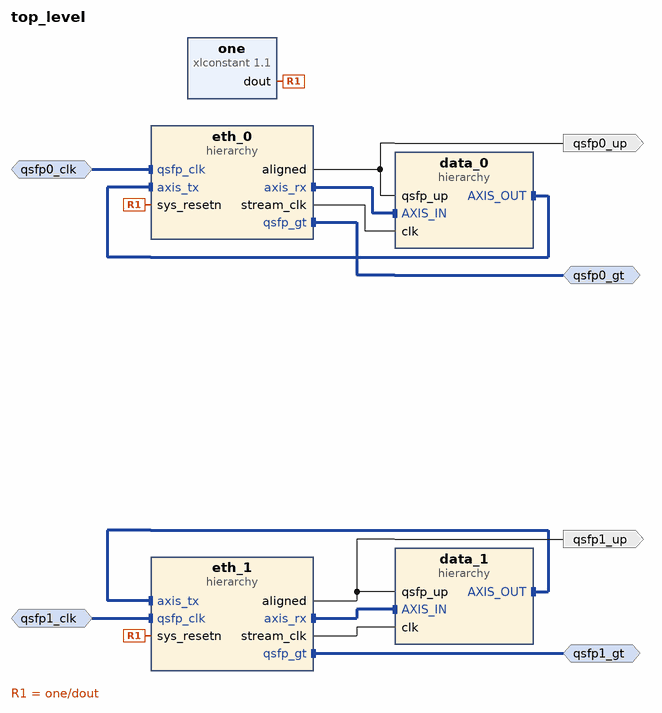
[diagram p0: block diagram of the top level]
# Vivado block design top_level, xcku15p-ffve1517-3-e, Vivado 2021.1
create_bd_design top_level

create_bd_intf_port -mode Slave -vlnv xilinx.com:interface:diff_clock_rtl:1.0 qsfp0_clk
set_property -dict {CONFIG.FREQ_HZ 156250000} [get_bd_intf_ports qsfp0_clk]
create_bd_intf_port -mode Master -vlnv xilinx.com:interface:gt_rtl:1.0 qsfp0_gt
create_bd_intf_port -mode Master -vlnv xilinx.com:interface:gt_rtl:1.0 qsfp1_gt
create_bd_intf_port -mode Slave -vlnv xilinx.com:interface:diff_clock_rtl:1.0 qsfp1_clk
set_property -dict {CONFIG.FREQ_HZ 156250000} [get_bd_intf_ports qsfp1_clk]
create_bd_port -dir O qsfp0_up
create_bd_port -dir O qsfp1_up

create_bd_cell -type hier eth_0
create_bd_cell -type hier eth_1
create_bd_cell -type ip -vlnv xilinx.com:ip:xlconstant:1.1 one
create_bd_cell -type hier data_1
create_bd_cell -type hier data_0

# ---- hierarchy /eth_0 ----
current_bd_instance /eth_0
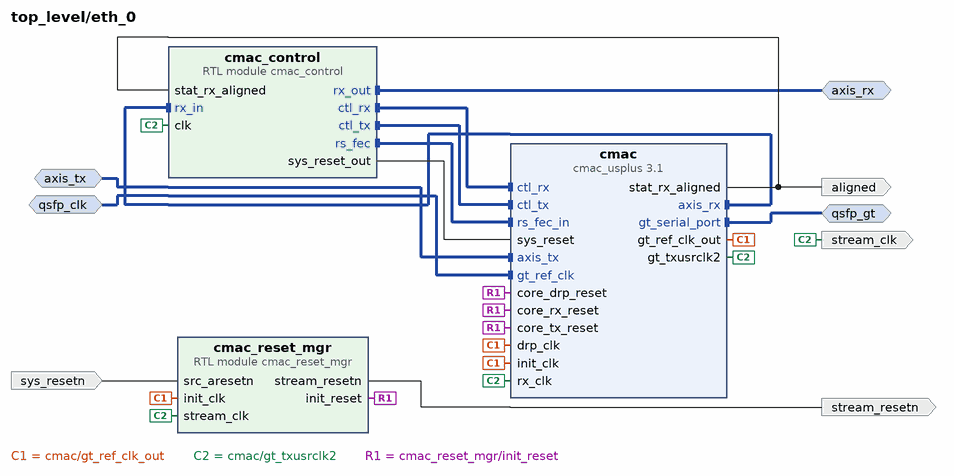
[diagram p1: block diagram inside /eth_0]
create_bd_intf_pin -mode Master -vlnv xilinx.com:interface:gt_rtl:1.0 qsfp_gt
create_bd_intf_pin -mode Slave -vlnv xilinx.com:interface:diff_clock_rtl:1.0 qsfp_clk
create_bd_intf_pin -mode Slave -vlnv xilinx.com:interface:axis_rtl:1.0 axis_tx
create_bd_intf_pin -mode Master -vlnv xilinx.com:interface:axis_rtl:1.0 axis_rx
create_bd_pin -dir I -type rst sys_resetn
create_bd_pin -dir O -type clk stream_clk
create_bd_pin -dir O -type rst stream_resetn
create_bd_pin -dir O aligned

create_bd_cell -type ip -vlnv xilinx.com:ip:cmac_usplus:3.1 cmac
set_property -dict [list \
  CONFIG.CMAC_CAUI4_MODE 1 \
  CONFIG.CMAC_CORE_SELECT CMACE4_X0Y0 \
  CONFIG.GT_DRP_CLK 156.25 \
  CONFIG.GT_GROUP_SELECT {X0Y0~X0Y3} \
  CONFIG.GT_REF_CLK_FREQ 156.25 \
  CONFIG.INCLUDE_RS_FEC 1 \
  CONFIG.NUM_LANES 4x25 \
  CONFIG.RX_FLOW_CONTROL 0 \
  CONFIG.TX_FLOW_CONTROL 0 \
  CONFIG.USER_INTERFACE AXIS \
] [get_bd_cells cmac]
create_bd_cell -type module -reference cmac_reset_mgr cmac_reset_mgr
create_bd_cell -type module -reference cmac_control cmac_control

# ---- hierarchy /eth_1 ----
current_bd_instance /eth_1
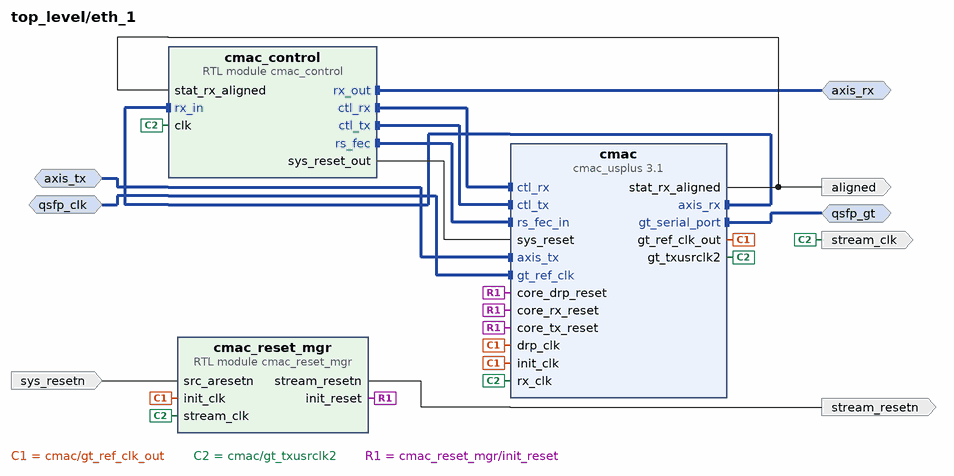
[diagram p2: block diagram inside /eth_1]
create_bd_intf_pin -mode Master -vlnv xilinx.com:interface:gt_rtl:1.0 qsfp_gt
create_bd_intf_pin -mode Slave -vlnv xilinx.com:interface:diff_clock_rtl:1.0 qsfp_clk
create_bd_intf_pin -mode Slave -vlnv xilinx.com:interface:axis_rtl:1.0 axis_tx
create_bd_intf_pin -mode Master -vlnv xilinx.com:interface:axis_rtl:1.0 axis_rx
create_bd_pin -dir I -type rst sys_resetn
create_bd_pin -dir O -type clk stream_clk
create_bd_pin -dir O -type rst stream_resetn
create_bd_pin -dir O aligned

create_bd_cell -type ip -vlnv xilinx.com:ip:cmac_usplus:3.1 cmac
set_property -dict [list \
  CONFIG.CMAC_CAUI4_MODE 1 \
  CONFIG.CMAC_CORE_SELECT CMACE4_X0Y1 \
  CONFIG.GT_DRP_CLK 156.25 \
  CONFIG.GT_GROUP_SELECT {X0Y4~X0Y7} \
  CONFIG.GT_REF_CLK_FREQ 156.25 \
  CONFIG.INCLUDE_RS_FEC 1 \
  CONFIG.NUM_LANES 4x25 \
  CONFIG.RX_FLOW_CONTROL 0 \
  CONFIG.TX_FLOW_CONTROL 0 \
  CONFIG.USER_INTERFACE AXIS \
] [get_bd_cells cmac]
create_bd_cell -type module -reference cmac_reset_mgr cmac_reset_mgr
create_bd_cell -type module -reference cmac_control cmac_control

# ---- hierarchy /data_1 ----
current_bd_instance /data_1
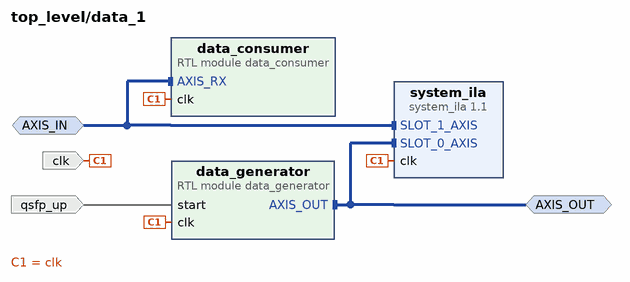
[diagram p3: block diagram inside /data_1]
create_bd_intf_pin -mode Master -vlnv xilinx.com:interface:axis_rtl:1.0 AXIS_OUT
create_bd_intf_pin -mode Slave -vlnv xilinx.com:interface:axis_rtl:1.0 AXIS_IN
create_bd_pin -dir I -type clk clk
create_bd_pin -dir I qsfp_up

create_bd_cell -type ip -vlnv xilinx.com:ip:system_ila:1.1 system_ila
set_property -dict [list \
  CONFIG.C_NUM_MONITOR_SLOTS 2 \
  CONFIG.C_SLOT 1 \
  CONFIG.C_SLOT_0_INTF_TYPE xilinx.com:interface:axis_rtl:1.0 \
  CONFIG.C_SLOT_1_INTF_TYPE xilinx.com:interface:axis_rtl:1.0 \
] [get_bd_cells system_ila]
create_bd_cell -type module -reference data_consumer data_consumer
create_bd_cell -type module -reference data_generator data_generator

# ---- hierarchy /data_0 ----
current_bd_instance /data_0
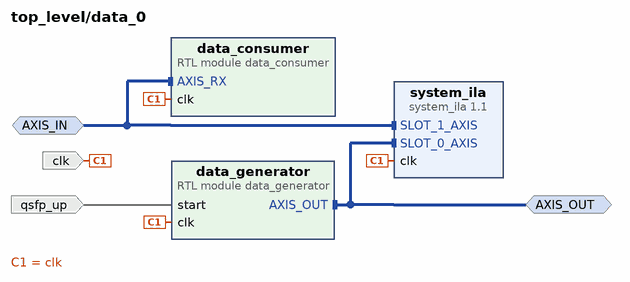
[diagram p4: block diagram inside /data_0]
create_bd_intf_pin -mode Master -vlnv xilinx.com:interface:axis_rtl:1.0 AXIS_OUT
create_bd_intf_pin -mode Slave -vlnv xilinx.com:interface:axis_rtl:1.0 AXIS_IN
create_bd_pin -dir I -type clk clk
create_bd_pin -dir I qsfp_up

create_bd_cell -type ip -vlnv xilinx.com:ip:system_ila:1.1 system_ila
set_property -dict [list \
  CONFIG.C_NUM_MONITOR_SLOTS 2 \
  CONFIG.C_SLOT 1 \
  CONFIG.C_SLOT_0_INTF_TYPE xilinx.com:interface:axis_rtl:1.0 \
  CONFIG.C_SLOT_1_INTF_TYPE xilinx.com:interface:axis_rtl:1.0 \
] [get_bd_cells system_ila]
create_bd_cell -type module -reference data_consumer data_consumer
create_bd_cell -type module -reference data_generator data_generator

# ---- connections ----

current_bd_instance /eth_0
connect_bd_intf_net [get_bd_intf_pins axis_tx] [get_bd_intf_pins cmac/axis_tx]
connect_bd_intf_net [get_bd_intf_pins cmac_control/rx_in] [get_bd_intf_pins cmac/axis_rx]
connect_bd_intf_net [get_bd_intf_pins cmac_control/ctl_rx] [get_bd_intf_pins cmac/ctl_rx]
connect_bd_intf_net [get_bd_intf_pins cmac_control/ctl_tx] [get_bd_intf_pins cmac/ctl_tx]
connect_bd_intf_net [get_bd_intf_pins cmac_control/rs_fec] [get_bd_intf_pins cmac/rs_fec_in]
connect_bd_intf_net [get_bd_intf_pins axis_rx] [get_bd_intf_pins cmac_control/rx_out]
connect_bd_intf_net [get_bd_intf_pins qsfp_gt] [get_bd_intf_pins cmac/gt_serial_port]
connect_bd_intf_net [get_bd_intf_pins qsfp_clk] [get_bd_intf_pins cmac/gt_ref_clk]
connect_bd_net -net clk_0_1 [get_bd_pins cmac/gt_ref_clk_out] \
  [get_bd_pins cmac/init_clk] [get_bd_pins cmac/drp_clk] [get_bd_pins cmac_reset_mgr/init_clk]
connect_bd_net [get_bd_pins cmac_control/sys_reset_out] [get_bd_pins cmac/sys_reset]
connect_bd_net -net cmac_gt_rxusrclk2 [get_bd_pins cmac/gt_txusrclk2] \
  [get_bd_pins cmac/rx_clk] [get_bd_pins stream_clk] [get_bd_pins cmac_reset_mgr/stream_clk] [get_bd_pins cmac_control/clk]
connect_bd_net -net cmac_reset_mgr_0_stream_resetn [get_bd_pins cmac_reset_mgr/stream_resetn] [get_bd_pins stream_resetn]
connect_bd_net [get_bd_pins cmac/stat_rx_aligned] [get_bd_pins aligned] [get_bd_pins cmac_control/stat_rx_aligned]
connect_bd_net -net init_clk_reset_peripheral_reset [get_bd_pins cmac_reset_mgr/init_reset] \
  [get_bd_pins cmac/core_rx_reset] [get_bd_pins cmac/core_tx_reset] [get_bd_pins cmac/core_drp_reset]
connect_bd_net -net sys_reset_1 [get_bd_pins sys_resetn] [get_bd_pins cmac_reset_mgr/src_aresetn]

current_bd_instance /eth_1
connect_bd_intf_net [get_bd_intf_pins axis_tx] [get_bd_intf_pins cmac/axis_tx]
connect_bd_intf_net [get_bd_intf_pins cmac_control/rx_in] [get_bd_intf_pins cmac/axis_rx]
connect_bd_intf_net [get_bd_intf_pins cmac_control/ctl_rx] [get_bd_intf_pins cmac/ctl_rx]
connect_bd_intf_net [get_bd_intf_pins cmac_control/ctl_tx] [get_bd_intf_pins cmac/ctl_tx]
connect_bd_intf_net [get_bd_intf_pins cmac_control/rs_fec] [get_bd_intf_pins cmac/rs_fec_in]
connect_bd_intf_net [get_bd_intf_pins axis_rx] [get_bd_intf_pins cmac_control/rx_out]
connect_bd_intf_net [get_bd_intf_pins qsfp_gt] [get_bd_intf_pins cmac/gt_serial_port]
connect_bd_intf_net [get_bd_intf_pins qsfp_clk] [get_bd_intf_pins cmac/gt_ref_clk]
connect_bd_net -net clk_0_1 [get_bd_pins cmac/gt_ref_clk_out] \
  [get_bd_pins cmac/init_clk] [get_bd_pins cmac/drp_clk] [get_bd_pins cmac_reset_mgr/init_clk]
connect_bd_net [get_bd_pins cmac_control/sys_reset_out] [get_bd_pins cmac/sys_reset]
connect_bd_net -net cmac_gt_rxusrclk2 [get_bd_pins cmac/gt_txusrclk2] \
  [get_bd_pins cmac/rx_clk] [get_bd_pins stream_clk] [get_bd_pins cmac_reset_mgr/stream_clk] [get_bd_pins cmac_control/clk]
connect_bd_net -net cmac_reset_mgr_0_stream_resetn [get_bd_pins cmac_reset_mgr/stream_resetn] [get_bd_pins stream_resetn]
connect_bd_net [get_bd_pins cmac/stat_rx_aligned] [get_bd_pins aligned] [get_bd_pins cmac_control/stat_rx_aligned]
connect_bd_net -net init_clk_reset_peripheral_reset [get_bd_pins cmac_reset_mgr/init_reset] \
  [get_bd_pins cmac/core_rx_reset] [get_bd_pins cmac/core_tx_reset] [get_bd_pins cmac/core_drp_reset]
connect_bd_net -net sys_reset_1 [get_bd_pins sys_resetn] [get_bd_pins cmac_reset_mgr/src_aresetn]

current_bd_instance /data_1
connect_bd_intf_net [get_bd_intf_pins AXIS_IN] [get_bd_intf_pins data_consumer/AXIS_RX]
connect_bd_intf_net [get_bd_intf_pins AXIS_IN] [get_bd_intf_pins system_ila/SLOT_1_AXIS]
connect_bd_intf_net [get_bd_intf_pins AXIS_OUT] [get_bd_intf_pins data_generator/AXIS_OUT]
connect_bd_intf_net [get_bd_intf_pins AXIS_OUT] [get_bd_intf_pins system_ila/SLOT_0_AXIS]
connect_bd_net -net eth_1_stat_rx_aligned_0 [get_bd_pins qsfp_up] [get_bd_pins data_generator/start]
connect_bd_net -net eth_1_stream_clk [get_bd_pins clk] [get_bd_pins data_consumer/clk] [get_bd_pins system_ila/clk] [get_bd_pins data_generator/clk]

current_bd_instance /data_0
connect_bd_intf_net [get_bd_intf_pins AXIS_IN] [get_bd_intf_pins data_consumer/AXIS_RX]
connect_bd_intf_net [get_bd_intf_pins AXIS_IN] [get_bd_intf_pins system_ila/SLOT_1_AXIS]
connect_bd_intf_net [get_bd_intf_pins AXIS_OUT] [get_bd_intf_pins data_generator/AXIS_OUT]
connect_bd_intf_net [get_bd_intf_pins AXIS_OUT] [get_bd_intf_pins system_ila/SLOT_0_AXIS]
connect_bd_net -net eth_1_stat_rx_aligned_0 [get_bd_pins qsfp_up] [get_bd_pins data_generator/start]
connect_bd_net -net eth_1_stream_clk [get_bd_pins clk] [get_bd_pins data_consumer/clk] [get_bd_pins system_ila/clk] [get_bd_pins data_generator/clk]

current_bd_instance /
connect_bd_intf_net [get_bd_intf_pins data_0/AXIS_IN] [get_bd_intf_pins eth_0/axis_rx]
connect_bd_intf_net [get_bd_intf_pins data_1/AXIS_IN] [get_bd_intf_pins eth_1/axis_rx]
connect_bd_intf_net [get_bd_intf_pins data_1/AXIS_OUT] [get_bd_intf_pins eth_1/axis_tx]
connect_bd_intf_net [get_bd_intf_ports qsfp0_gt] [get_bd_intf_pins eth_0/qsfp_gt]
connect_bd_intf_net [get_bd_intf_pins data_0/AXIS_OUT] [get_bd_intf_pins eth_0/axis_tx]
connect_bd_intf_net [get_bd_intf_ports qsfp1_gt] [get_bd_intf_pins eth_1/qsfp_gt]
connect_bd_intf_net [get_bd_intf_ports qsfp0_clk] [get_bd_intf_pins eth_0/qsfp_clk]
connect_bd_intf_net [get_bd_intf_ports qsfp1_clk] [get_bd_intf_pins eth_1/qsfp_clk]
connect_bd_net -net clk_1 [get_bd_pins eth_0/stream_clk] [get_bd_pins data_0/clk]
connect_bd_net -net eth_0_stat_rx_aligned_0 [get_bd_pins eth_0/aligned] [get_bd_ports qsfp0_up] [get_bd_pins data_0/qsfp_up]
connect_bd_net -net eth_1_stat_rx_aligned_0 [get_bd_pins eth_1/aligned] [get_bd_ports qsfp1_up] [get_bd_pins data_1/qsfp_up]
connect_bd_net [get_bd_pins eth_1/stream_clk] [get_bd_pins data_1/clk]
connect_bd_net [get_bd_pins one/dout] [get_bd_pins eth_0/sys_resetn] [get_bd_pins eth_1/sys_resetn]

validate_bd_design
save_bd_design
